# Altium schematic sheet Power.SchDoc
size A; SheetNumber: 1; SheetTotal: 4
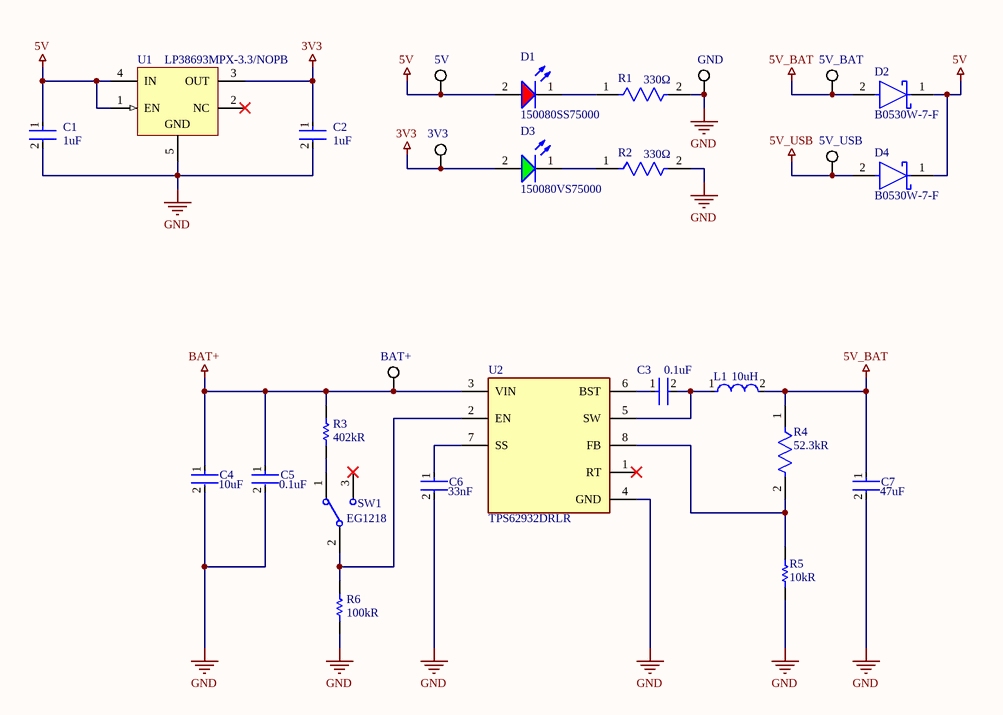
[diagram p0: Power.SchDoc]

## Parts
3V3  (no value)  [KSTN-5019_V]
5V  (no value)  [KSTN-5019_V]
5V_BAT  (no value)  [KSTN-5019_V]
5V_USB  (no value)  [KSTN-5019_V]
BAT+  (no value)  [KSTN-5019_V]
C1  Capacitance: 1uF  [FP-CC0805-0_85-MFG]  (hidden comment: CC0805MKX7R7BB105)
C2  Capacitance: 1uF  [FP-CC0805-0_85-MFG]  (hidden comment: CC0805MKX7R7BB105)
C3  Capacitance: 0.1uF  [FP-GCD21B-0_15-IPC_B]  (hidden comment: GCD21BR71H104MA01L)
C4  Capacitance: 10uF  [FP-GRM21B-0_2-e0_2_0_7-IPC_A]  (hidden comment: GRM21BR61H106KE43L)
C5  Capacitance: 0.1uF  [FP-GCD21B-0_15-IPC_B]  (hidden comment: GCD21BR71H104MA01L)
C6  Capacitance: 33nF  [FP-C0805C-DN-MFG]  (hidden comment: C0805C333K5RACAUTO)
C7  Capacitance: 47uF  [FP-GRM21B-0_2-e0_2_0_7-IPC_A]  (hidden comment: GRM21BR61A476ME15L)
D1  150080SS75000  [WL-SMCW_0805_150080xx75000]
D2  B0530W-7-F  [FP-SOD123-MFG]
D3  150080VS75000  [WL-SMCW_0805_150080xx75000]
D4  B0530W-7-F  [FP-SOD123-MFG]
GND  (no value)  [KSTN-5019_V]
L1  Inductance: 10uH  [FP-SRP1038A-100M-MFG]  (hidden comment: SRP1038A-100M)
R1  Resistance: 330Ω  [FP-AC0805-MFG]  (hidden comment: AC0805FR-07330RL)
R2  Resistance: 330Ω  [FP-AC0805-MFG]  (hidden comment: AC0805FR-07330RL)
R3  Resistance: 402kR  [RESC2013X60X35NL10T20]  (hidden comment: RC0805FR-07402KL)
R4  Resistance: 52.3kR  [FP-CRCW0805-e3-IPC_A]  (hidden comment: CRCW080552K3FKEA)
R5  value 10kR  [RESC2013X60X35NL10T20]  (hidden comment: RC0805FR-0710KL)
R6  Resistance: 100kR  [RESC2013X60X30LL20T20]  (hidden comment: SG73S2ATTD1003F)
SW1  EG1218  [ESWI-EG1218_V]
U1  LP38693MPX-3.3/NOPB  [MP05A_M]
U2  TPS62932DRLR  [FP-DRL0008A-MFG]

## Nets
3V3: 3V3.1 C2.1 D3.2(A) U1.3(OUT)
5V: 5V.1 C1.1 D1.2(A) D2.1(C) D4.1(C) U1.1(EN) U1.4(IN)
5V_BAT: 5V_BAT.1 C7.1 D2.2(A) L1.2 R4.1
5V_USB: 5V_USB.1 D4.2(A)
BAT+: BAT+.1 C4.1 C5.1 R3.2 U2.3(VIN)
GND: C1.2 C2.2 C4.2 C5.2 C6.2 C7.2 GND.1 R1.2 R2.2 R5.2 R6.1 U1.5(GND) U2.4(GND)
NetC3_1: C3.1 U2.6(BST)
NetC3_2: C3.2 L1.1 U2.5(SW)
NetC6_1: C6.1 U2.7(SS)
NetD1_1: D1.1(K) R1.1
NetD3_1: D3.1(K) R2.1
NetR3_1: R3.1 SW1.1
NetR4_2: R4.2 R5.1 U2.8(FB)
NetR6_2: R6.2 SW1.2(COM) U2.2(EN)

Not connected (* = marked no-connect by the designer): SW1 3*; U1 2(NC)*; U2 1(RT)*

## Library data of the parts
3V3 5V 5V_BAT 5V_USB BAT+ GND = CMP-1672-00008-1: Test Point, 1 Position SMD, RoHS, Tape and Reel; Manufacturer: Keystone Electronics; Manufacturer Part Number: 5019; Connector Type: Interconnection Device; ComponentLink1Description: Manufacturer URL; Package Quantity: 1000; DatasheetVersion: 03/2014; Packaging: Tape and Reel; ComponentLink2URL: http://www.keyelco.com/product-pdf.cfm?p=1357; ComponentLink1URL: http://www.keyelco.com/; Mount: Surface Mount; Contact Plating: Silver; PackageDescription: 1-Pin Surface Mount Device, Body 3.81 x 2.03 mm; Pins: 1; RoHSCompliant: True; Mounting Technology: Surface Mount; ComponentLink2Description: Datasheet; PackageReference: 5019; Supplier: Digikey; Supplier Part Number: 36-5019CT-ND; RoHS: Yes; Category: Connectors; Stock: 174520; Pricing: 1=0.34, 25=0.2736, 100=0.2234, 250=0.20064, 500=0.19152 (USD); Reach SVHC Compliant: Yes; RoHS Compliant: Yes; ComponentLink3URL: https://datasheet.ciiva.com:443/pdfs/VipMasterIC/IC/KEYC/KEYC-S-A0003063693/KEYC-S-A0003063693-1.pdf?src-supplier=IHS+Markit; ComponentLink3Description: https://datasheet.ciiva.com:443/pdfs/VipMasterIC/IC/KEYC/KEYC-S-A0003063693/KEYC-S-A0003063693-1.pdf?src-supplier=IHS+Markit; ComponentLink4URL: https://datasheet.ciiva.com/16318/m60-2p61-16318395.pdf?src-supplier=Future+Electronics; ComponentLink4Description: https://datasheet.ciiva.com/16318/m60-2p61-16318395.pdf?src-supplier=Future+Electronics; ComponentLink5URL: https://datasheet.ciiva.com/14848/m60-2p61-14848438.pdf?src-supplier=Digikey; ComponentLink5Description: https://datasheet.ciiva.com/14848/m60-2p61-14848438.pdf?src-supplier=Digikey; ComponentLink6URL: https://datasheet.ciiva.com/14848/m60-2p61-14848439.pdf?src-supplier=Digikey; ComponentLink6Description: https://datasheet.ciiva.com/14848/m60-2p61-14848439.pdf?src-supplier=Digikey; ComponentLink7URL: https://datasheet.ciiva.com/14848/m60-2p61-14848437.pdf?src-supplier=Digikey; ComponentLink7Description: https://datasheet.ciiva.com/14848/m60-2p61-14848437.pdf?src-supplier=Digikey; ComponentLink8URL: https://datasheet.ciiva.com/16885/70182998-16885945.pdf?src-supplier=Allied+Electronics; ComponentLink8Description: https://datasheet.ciiva.com/16885/70182998-16885945.pdf?src-supplier=Allied+Electronics
C1 C2 = CMP-03422-001156-1: CAP CER 1UF 16V X7R 0805; Manufacturer: Yageo; Material: Ceramic; Tolerance: 0.2; Octopart: https://octopart.com/cc0805mkx7r7bb105-yageo-33242308; Footprint Url: http://www.yageo.com/exep/pages/download/literatures/UPY-C_GEN_24.pdf; Height: 0.95mm; Manufacturer Part Number: CC0805MKX7R7BB105; ComponentLink2Description: Datasheet; Device Class L2: Capacitors; Package: CC0805-0.85; RoHS: TRUE; Category: Cap; Device Class L1: Passive Components; Device Class L3: Ceramic Capacitors; Ipc Land Pattern Name: CAPC200125X85; Temperature Range Low: -30°C; ComponentLink2URL: http://www.yageo.com/documents/recent/UPY-GPHC_Y5V_6.3V-to-50V_8.pdf; Temperature: -30°C to +85°C; Automotive: No; Temperature Range High: +85°C; Mouser Description: Multilayer Ceramic Capacitors MLCC - SMD/SMT 1.0uF 16V X7R 20%; Digikey Description: CAP CER 1UF 16V X7R 0805; Voltage Rating: 16 V; Value: 1 uF; Lead Free: Yes; Temperature Characteristic: X7R
C3 C5 = CMP-06035-004518-1: Chip Multilayer Ceramic Capacitors for Automotive, 0805, 0.10uF, X7R, 15%, 20%, 50V, Grade 1
C4 = CMP-06035-004402-1: Chip Multilayer Ceramic Capacitors for General Purpose, 0805, 10uF, X5R, 15%, 10%, 50V; Voltage Rating (DC): 50V; Dielectric: X5R; Tolerance: 10%; Thickness: 1.25mm; Length: 2mm; Width: 1.25mm
C6 = CMP-2007-01069-2: CAP CER 0.033UF 50V X7R 0805; Manufacturer: KEMET; Tolerance: 0.1; Temperature Coefficient: 30ppm/°C; Value: 33,000 pF; Material: Ceramic; Temperature Characteristic: X7R; Ipc Land Pattern Name: CAPC200125X78; ComponentLink2Description: Datasheet; Temperature Range High: +125°C; Lead Free: Yes; Height: 0.88mm; Temperature: -55°C to +125°C; Voltage Rating: 50 V; Package: C0805C-DN; Mouser Description: SMD Multilayer Ceramic Capacitor, AEC-Q200 C Series, 0.033 F, 10%, X7R, 50 V, 0805 [2012 Metric]; RoHS: TRUE; Device Class L2: Capacitors; Device Class L1: Passive Components; Digikey Description: CAP CER 0.033UF 50V X7R 0805; Automotive: No; Temperature Range Low: -55°C; Category: Cap; Manufacturer Part Number: C0805C333K5RACAUTO; Device Class L3: Ceramic Capacitors; ComponentLink2URL: https://content.kemet.com/datasheets/KEM_C1003_C0G_SMD.pdf; Octopart: https://octopart.com/c0805c333k5racauto-kemet-21768584
C7 = CMP-2000-06341-2: Chip Multilayer Ceramic Capacitors for General Purpose, 0805, 47uF, X5R, 15%, 20%, 10V; Dissipation Factor: 0.035%; Length: 2mm; Voltage Rating: 10V; Mount: Surface Mount; Width: 0.049inch; Voltage Rating (DC): 10V; Lead Free: Lead Free; REACH SVHC: No SVHC; Termination: SMD/SMT; Case/Package: 0805; Dielectric: X5R; Packaging: Tape and Reel; Max Operating Temperature: 85°C; Tolerance: 20%; Thickness: 0.057inch; Dielectric Material: Ceramic; Min Operating Temperature: -55°C; Height: 1.25mm; Case Code (Imperial): 0805; Case Code (Metric): 2012; Depth: 1.25mm; Voltage: 10V
D1 = CMP-1426-00010-4: Led, Red, 630 Nm, 1.9 V, 30 Ma, 60 Mcd Rohs Compliant: Yes; Reverse Voltage: 5V; Test Current: 20mA; Forward Current: 100mA; Power Dissipation: 72mW; Peak Wavelength: 645nm; Lens Style: Clear, Rectangular; Viewing Angle: 140°; Forward Voltage: 1.9V; Luminous Intensity: 60mcd; Wavelength: 630nm; Max Junction Temperature (Tj): 95°C; Color: Red; Case/Package: 0805; Length: 2mm; RoHS: Compliant; Max Operating Temperature: 85°C; Min Operating Temperature: -40°C; Case Code (Metric): 2012; Case Code (Imperial): 0805; Dominant Wavelength: 630nm; Max Reverse Voltage (DC): 5V; REACH SVHC: Unknown; Packaging: Tape and Reel; Mount: Surface Mount; Width: 1.25mm; Height: 700µm
D2 D4 = CMP-2000-05879-2: DIODE SCHOTTKY 30V 500MA SOD123; Manufacturer: Diodes Inc.; Max Surge Forward Current: 5.5A; Forward Current: 0.5A; Max Junction Temp: +125°C; Standoff Height: 0mm; Capacitance: 170pF; Value: 170pF; Peak Reverse Current: 130uA; Footprint Url: https://www.diodes.com/assets/Package-Files/SOD123.pdf; Device Class L1: Discrete Semiconductors; ComponentLink2Description: Datasheet; Mouser Description: Schottky Diodes & Rectifiers 30V 410mW; Device Class L3: Schottky Diodes; Package: SOD123; Temperature: -65°C to +125°C; Temperature Range Low: -65°C; Lead Free: Yes; Digikey Description: DIODE SCHOTTKY 30V 500MA SOD123; Ipc Land Pattern Name: SOD365155X123-2; Automotive: No; Octopart: https://octopart.com/b0530w-7-f-diodes+inc.-325721; Device Class L2: Diodes; ComponentLink2URL: https://www.diodes.com/assets/Datasheets/ds30139.pdf; RoHS: TRUE; Height: 1.45mm; Max Repetitive Reverse Voltage: 30V; Category: Diode; Temperature Range High: +125°C; Manufacturer Part Number: B0530W-7-F; Reverse Voltage: 30V
D3 = CMP-1426-00009-6: WL-SMCW SMT Mono-Color Chip LED Waterclear; Max Junction Temperature (Tj): 95°C; Max Reverse Voltage (DC): 5V; Luminous Intensity: 40mcd; Color: Green; Peak Wavelength: 572nm; Wavelength: 570nm; Viewing Angle: 140°; Power Dissipation: 72mW; Forward Current: 100mA; Test Current: 20mA; Forward Voltage: 2V; Lens Style: Clear, Rectangular; Reverse Voltage: 5V; Length: 2mm; RoHS: Compliant; Min Operating Temperature: -40°C; REACH SVHC: Unknown; Packaging: Tape and Reel; Case/Package: 0805; Max Operating Temperature: 85°C; Case Code (Metric): 2012; Width: 1.25mm; Dominant Wavelength: 570nm; Mount: Surface Mount; Case Code (Imperial): 0805; Height: 700µm
L1 = CMP-07248-000083-1: FIXED IND 10UH 7.5A 30 MOHM SMD; Tolerance: 20%; Test Frequency: 100kHz; Self Resonant Frequency: 10MHz; Q Factor: 20; Core Material: Carbonyl Powder; Shielding: Shielded; DC Resistance (DCR): 30mR; Saturation Current: 12A; Mount: Surface Mount; Military Standard: Not; Max Operating Temperature: 150°C; Length: 11mm; Min Operating Temperature: -40°C; Ratings: AEC-Q200; Termination: SMD/SMT; RMS Current (Irms): 7.5A; Packaging: Tape and Reel; RoHS Compliant: Yes; Width: 0.394inch; Height: 3.8mm; Package Quantity: 500; DC Current: 7.5A; Case/Package: Nonstandard; Depth: 10.3mm; Max DC Current: 7.5A; Height - Seated (Max): 0.157inch; REACH SVHC: No SVHC; Resistor Type: Wirewound; Current Rating: 7.5A; Inductance Tolerance: 20%
R1 R2 = CMP-03412-037341-1: RES SMD 330 OHM 1% 1/8W 0805; Manufacturer: Yageo; Tolerance: 0.01; Value: 330Ω; Automotive Grade: Grade 0; Voltage Rating: 150V; ComponentLink2URL: http://www.yageo.com/documents/recent/PYu-AC_51_RoHS_L_6.pdf; Power Rating: 1/8W; Height: 0.6mm; Automotive: Yes; Mouser Description: Thick Film Resistors - SMD 1/8W 330ohm 1% AEC-Q200; Manufacturer Part Number: AC0805FR-07330RL; Composition: Thick Film; Category: Res; ComponentLink2Description: Datasheet; Temperature Range Low: -55°C; Ipc Land Pattern Name: RESC200125X50; RoHS: TRUE; Lead Free: Yes; Digikey Description: RES SMD 330 OHM 1% 1/8W 0805; Temperature Range High: +155°C; Device Class L1: Passive Components; Octopart: https://octopart.com/ac0805fr-07330rl-yageo-51059920; Footprint Url: http://www.yageo.com/exep/pages/download/literatures/PYu-R_Mount_10.pdf; Device Class L3: Chip SMD Resistors; Series: AC; Temperature: -55°C to +155°C; Package: AC0805; Device Class L2: Resistors
R3 = CMP-2001-01136-1: Manufacturer: Yageo; Part Number: RC0805FR-07402KL
R4 = CMP-1013-00705-3: RES Thick Film, 52.3kΩ, 1%, 0.125W, 100ppm/°C, 0805; Voltage Rating: 150V; Power Rating: 125mW; Min Operating Temperature: -55°C; Military Standard: Not; Features: Automotive AEC-Q200; Composition: Thick Film; Case/Package: 0805; Case Code (Imperial): 0805; Length: 2mm; Package Quantity: 10; Radiation Hardening: No; Max Operating Temperature: 155°C; Contact Plating: Tin; Case Code (Metric): 2012; Temperature Coefficient: 100ppm/°C; Weight: 0.000194oz; Number of Pins: 2; Number of Terminations: 2; Depth: 1.25mm; Termination: Solder; Tolerance: 1%; Max Power Dissipation: 125mW; Lead Free: Lead Free; Packaging: Tape and Reel; Width: 0.049inch; Height: 0.45mm; Voltage Rating (DC): 150V
R5 = CMP-1659-00013-4: Chip Resistor, 10 KOhm, +/- 1%, 0.125 W, -55 to 155 degC, 0805 (2012 Metric), RoHS, Tape and Reel; Manufacturer: Yageo; Voltage Rating: 150 V; Power: 125mW; Rated Temperature: 70°C; Temperature Coefficient: 100ppm/°C; Additional Feature: LASER TRIMMABLE; Working Voltage: 150V; Package Length: 2mm; Package Height: 0.5mm; Package Width: 1.25mm; Mount: Surface Mount; ComponentLink1Description: Manufacturer URL; ComponentLink2URL: http://www.yageo.com/documents/recent/PYu-RC_Group_51_RoHS_L_04.pdf; Pins: 2; Length: 2 mm; Min Operating Temperature: -55 degC; Height: 0.5 mm; Mounting Technology: Surface Mount; RoHSCompliant: true; REACH SVHC: No SVHC; ComponentLink1URL: http://www.yageo.com/; Max Operating Temperature: 155 degC; PackageReference: 0805; DatasheetVersion: Rev. 4, 02/2016; Package Quantity: 5000; Packaging: Tape and Reel; ComponentLink2Description: Datasheet; PackageDescription: 2-Pin Surface Mounted Device, Body 2 x 1.25 mm; Supplier: Digikey; Supplier Part Number: 311-10.0KCRCT-ND; Manufacturer Part Number: RC0805FR-0710KL; RoHS: Yes; Category: Chip SMD Resistors; Stock: 4430741; Pricing: 1=0.1, 10=0.027, 50=0.017, 100=0.0142, 500=0.00976, 1000=0.00844 (USD); Package Shape: Rectangular; Terminal Finish: Nickel; Case/Package: 0805; Tolerance: 1%; JESD-609 Code: e3; Resistor Type: FIXED RESISTOR; Construction: Chip; Package Style: SMTMeter; Technology: METAL GLAZE/THICK FILM; Termination: Wraparound; Reach SVHC Compliant: Yes; RoHS Compliant: Yes; ComponentLink3URL: https://datasheet.ciiva.com:443/pdfs/VipMasterIC/IC/YAGO/YAGO-S-A0008145938/YAGO-S-A0008145938-1.pdf?src-supplier=IHS+Markit; ComponentLink3Description: https://datasheet.ciiva.com:443/pdfs/VipMasterIC/IC/YAGO/YAGO-S-A0008145938/YAGO-S-A0008145938-1.pdf?src-supplier=IHS+Markit; ComponentLink4URL: https://datasheet.ciiva.com/11808/0900766b8106beab-11808151.pdf?src-supplier=Rs; ComponentLink4Description: https://datasheet.ciiva.com/11808/0900766b8106beab-11808151.pdf?src-supplier=Rs; ComponentLink5URL: https://datasheet.ciiva.com/46447/444164-46447563.pdf?src-supplier=Element14; ComponentLink5Description: https://datasheet.ciiva.com/46447/444164-46447563.pdf?src-supplier=Element14; ComponentLink6URL: https://datasheet.ciiva.com/2456/pyu-r-int-thick-7-2456973.pdf?src-supplier=Digikey; ComponentLink6Description: https://datasheet.ciiva.com/2456/pyu-r-int-thick-7-2456973.pdf?src-supplier=Digikey; ComponentLink7URL: https://datasheet.ciiva.com/2456/pyu-r-int-thick-7-2456974.pdf?src-supplier=Digikey; ComponentLink7Description: https://datasheet.ciiva.com/2456/pyu-r-int-thick-7-2456974.pdf?src-supplier=Digikey; ComponentLink8URL: https://datasheet.ciiva.com/2456/pyu-r-int-thick-7-2456972.pdf?src-supplier=Digikey; ComponentLink8Description: https://datasheet.ciiva.com/2456/pyu-r-int-thick-7-2456972.pdf?src-supplier=Digikey; ComponentLink9URL: https://datasheet.ciiva.com/12669/rc0805-12669688.pdf?src-supplier=Mouser; ComponentLink9Description: https://datasheet.ciiva.com/12669/rc0805-12669688.pdf?src-supplier=Mouser; ComponentLink10URL: https://datasheet.ciiva.com/16747/rc0805-16747087.pdf?src-supplier=Future+Electronics; ComponentLink10Description: https://datasheet.ciiva.com/16747/rc0805-16747087.pdf?src-supplier=Future+Electronics
R6 = CMP-2001-02684-1: Manufacturer: KOA Speer; Part Number: SG73S2ATTD1003F
SW1 = CMP-1696-00002-1: Slide Switch, 500 V, -20 to 70 degC, 3-Pin THD, RoHS; Case\Package: SOT-23-5; Output Current: 150 mA; Nominal Output Voltage: 3.3 V; Max Power Dissipation: 250 mW; Min Input Voltage: 4.3 V; Outputs: 1; Max Input Voltage: 8 V; Dropout Voltage: 300 mV; PackageDescription: 3-Pin Through Hole Device, Body 11.6 x 4 mm, Pitch 2.5 mm; ComponentLink1URL: http://www.e-switch.ch/en/; RoHSCompliant: true; Length: 3 mm; ComponentLink1Description: Manufacturer URL; Power Rating: 250 mW; Mount: Surface Mount; Max Operating Temperature: 85 degC; REACH SVHC: No SVHC; Radiation Hardening: No; Height: 1.3 mm; Pins: 5; Max Ouput Current: 150 mA; Output Voltage: 3.3 V; Width: 1.8 mm; Package Quantity: 3000; ComponentLink2URL: https://www.e-switch.com/system/asset/product_line/data_sheet/119/EG.pdf; Min Operating Temperature: -40 degC; ComponentLink2Description: Datasheet; DatasheetVersion: Oct-15; PackageReference: EG1218; Packaging: Tape and Reel
U1 = CMP-0062-02672-1: 500mA Low Dropout CMOS Linear Regulators Stable with Ceramic Output Capacitors, 5-pin SOT-223, 2000 Reel; Manufacturer: National Semiconductor; PowerWise: Y; CompType: LDO IC; PinCount: 5; Code_JEDEC: TO-261-AB; ComponentLink3URL: http://www.national.com/pf/LP/LP38693.html; RoHS: Y; ComponentLink1URL: http://www.national.com/; Code_IPC: SOT223-5; PartNumber: LP38693MPX-3.3/NOPB; DatasheetVersion: Jun-2011; High-Reliability: Y; PackageReference: MP05A; ComponentLink4URL: http://www.national.com/packaging/folders/mp05a.html; ComponentLink2Description: LP38693 Datasheet; ComponentLink4Description: MP05A Package Page; PackageDescription: Moldec SOT-223, 6.50 x 3.56 x 1.6mm Body, 5 Lead, 1.5mm Pitch; ComponentLink2URL: http://www.national.com/ds/LP/LP38691.pdf; ComponentLink1Description: Manufacturer URL; ComponentLink3Description: LP38693 Web Page; PackageVersion: revA, Jan-2000
U2 = CMP-04918-000714-1: 3.8-V TO 30-V INPUT, 2-A, 200-KH